# Altium schematic sheet Microcontroller.SchDoc
size A4
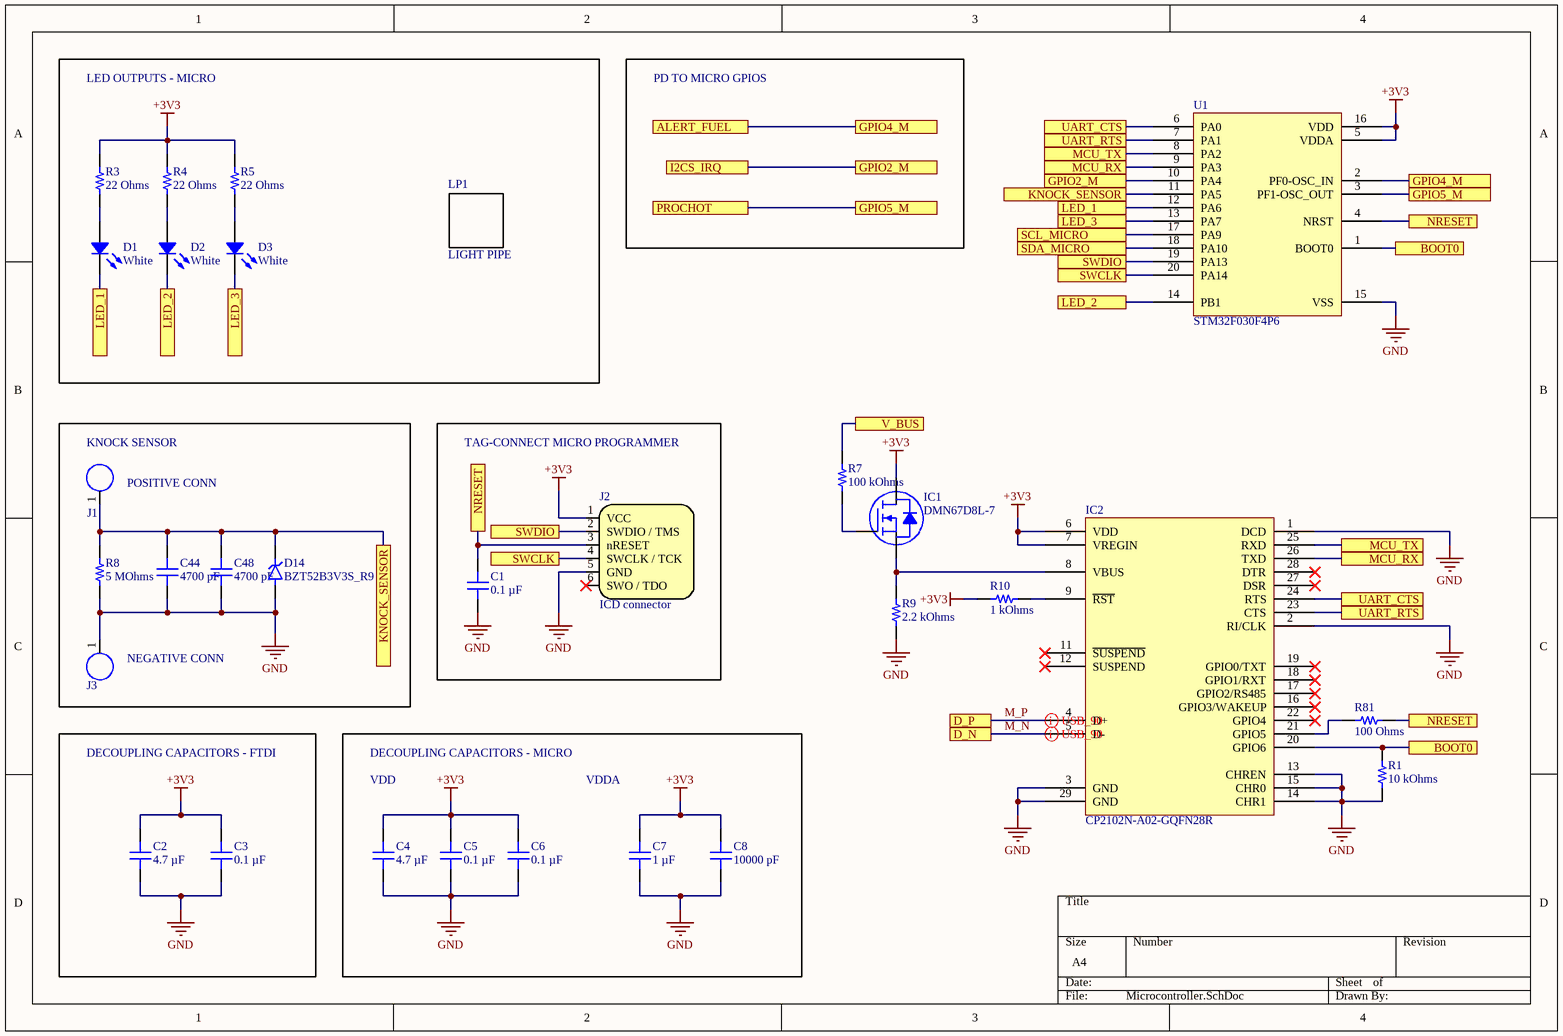
[diagram p0: Microcontroller.SchDoc]

## Parts
C1  0.1 µF  [CAP 0402_1005]
C2  4.7 µF  [CAP 0402_1005]
C3  0.1 µF  [CAP 0402_1005]
C4  4.7 µF  [CAP 0402_1005]
C5  0.1 µF  [CAP 0402_1005]
C6  0.1 µF  [CAP 0402_1005]
C7  1 µF  [CAP 0402_1005]
C8  10000 pF  [CAP 0402_1005]
C44  4700 pF  [CAP 0402_1005]
C48  4700 pF  [CAP 0402_1005]
D1  White  [LED 0805_2012]
D2  White  [LED 0805_2012]
D3  White  [LED 0805_2012]
D14  BZT52B3V3S_R9  [DIO_BZT52B3V3S_R9]
IC1  DMN67D8L-7  [DIODES SOT-23-3]
IC2  CP2102N-A02-GQFN28R  [SILICON LABS QFN-28 5x5MM]
J1  Large Board Solder Point  [Large Solder Point]  (value not drawn)  (no BOM)
J2  ICD connector  [TC2030-MCP]  (no BOM)
J3  Large Board Solder Point  [Large Solder Point]  (value not drawn)  (no BOM)
LP1  LIGHT PIPE  [Dialight 515-1069F]
R1  10 kOhms  [RES 0402_1005]
R3  22 Ohms  [RES 1206_3216]
R4  22 Ohms  [RES 1206_3216]
R5  22 Ohms  [RES 1206_3216]
R7  100 kOhms  [RES 0603_1608]
R8  5 MOhms  [RES 0603_1608]
R9  2.2 kOhms  [RES 0402_1005]
R10  1 kOhms  [RES 0402_1005]
R81  100 Ohms  [RES 0402_1005]
U1  STM32F030F4P6  [TSOP65P640X120-20N]

## Blocks framed on the sheet
LED OUTPUTS - MICRO: D1-D3 LP1 R3-R5
TAG-CONNECT MICRO PROGRAMMER: C1 J2
DECOUPLING CAPACITORS - FTDI: C2 C3

## Ports
ALERT_FUEL, BOOT0, D_N, D_P, GPIO2_M, GPIO4_M, GPIO5_M, I2CS_IRQ, KNOCK_SENSOR, LED_1, LED_2, LED_3, MCU_RX, MCU_TX, NRESET, PROCHOT, SCL_MICRO, SDA_MICRO, SWCLK, SWDIO, UART_CTS, UART_RTS, V_BUS

## Nets
+3V3: C2.2 C3.2 C4.2 C5.2 C6.2 C7.2 C8.2 IC1.3(D) IC2.6(VDD) IC2.7(VREGIN) J2.1(VCC) R3.2 R4.2 R5.2 R10.1 U1.5(VDDA) U1.16(VDD)
GND: C1.1 C2.1 C3.1 C4.1 C5.1 C6.1 C7.1 C8.1 C44.1 C48.1 D14.A IC2.1(DCD) IC2.2(RI/CLK) IC2.3(GND) IC2.13(CHREN) IC2.14(CHR1) IC2.15(CHR0) IC2.29(GND) J2.5(GND) J3.1 R1.2 R8.1 R9.1 U1.15(VSS)
ALERT_FUEL: U1.2(PF0-OSC_IN) ; port GPIO4_M, port ALERT_FUEL
BOOT0: IC2.20(GPIO6) R1.1 U1.1(BOOT0) ; port BOOT0
GPIO2_M: U1.10(PA4) ; port GPIO2_M, port I2CS_IRQ
GPIO5_M: U1.3(PF1-OSC_OUT) ; port GPIO5_M, port PROCHOT
KNOCK_SENSOR: C44.2 C48.2 D14.C(K) J1.1 R8.2 U1.11(PA5) ; port KNOCK_SENSOR
LED_1: D1.2 U1.12(PA6) ; port LED_1
LED_2: D2.2 U1.14(PB1) ; port LED_2
LED_3: D3.2 U1.13(PA7) ; port LED_3
M_N: IC2.5(D-) ; port D_N
M_P: IC2.4(D+) ; port D_P
MCU_RX: IC2.26(TXD) U1.9(PA3) ; port MCU_RX
MCU_TX: IC2.25(RXD) U1.8(PA2) ; port MCU_TX
NRESET: C1.2 J2.3(nRESET) R81.2 U1.4(NRST) ; port NRESET
SCL_MICRO: U1.17(PA9) ; port SCL_MICRO
SDA_MICRO: U1.18(PA10) ; port SDA_MICRO
SWCLK: J2.4(SWCLK_/_TCK) U1.20(PA14) ; port SWCLK
SWDIO: J2.2(SWDIO_/_TMS) U1.19(PA13) ; port SWDIO
UART_CTS: IC2.24(RTS) U1.6(PA0) ; port UART_CTS
UART_RTS: IC2.23(CTS) U1.7(PA1) ; port UART_RTS
V_BUS: R7.2 ; port V_BUS
NetD1_1: D1.1 R3.1
NetD2_1: D2.1 R4.1
NetD3_1: D3.1 R5.1
NetIC1_1: IC1.1(G) R7.1
NetIC1_2: IC1.2(S) IC2.8(VBUS) R9.2
NetIC2_9: IC2.9(~{RST}) R10.2
NetIC2_21: IC2.21(GPIO5) R81.1

Not connected (* = marked no-connect by the designer): IC2 11(~{SUSPEND})* 12(SUSPEND)* 16(GPIO3/WAKEUP)* 17(GPIO2/RS485)* 18(GPIO1/RXT)* 19(GPIO0/TXT)* 22(GPIO4)* 27(DSR)* 28(DTR)*; J2 6(SWO_/_TDO)*

## Layout directives
differential pair; differential pair class USB_90: M_N, M_P

## Notes on the sheet
- PD TO MICRO GPIOS
- (near J1) KNOCK SENSOR
- (near J1) POSITIVE CONN
- (near J3) NEGATIVE CONN
- DECOUPLING CAPACITORS - MICRO
- VDD
- VDDA

## Library data of the parts
C1 C3 C5 C6 = LMK105BJ104MC-F: CAP CER 0.1UF 10V X5R 0402; manufacturer: Taiyo Yuden; Tolerance: ±20%; Part Number: LMK105BJ104MC-F; Value: 0.1 µF; Applications: SMPS Filtering; Capacitance: 0.1 µF; componentlink1description: Datasheet; componentlink1url: https://www.yuden.co.jp/productdata/catalog/mlcc01_e.pdf; componentlink2description: DigiKey Link; componentlink2url: https://www.digikey.com/en/products/detail/taiyo-yuden/LMK105BJ104MC-F/6035743; Device Package: 0402 (1005 Metric); lastupdated: 9/08/2022 12:01:16 PM; Lifecycle Status: Active; Minimum Order: 1; Mounting Type: Surface Mount, MLCC; Operating Temperature: -55°C ~ 85°C; Package / Case: 0402 (1005 Metric); packaging: TapeAndReel; partid: 2414; Part Status: Active; price: 0.03; series: M; Size / Dimension: 0.039" L x 0.020" W (1.00mm x 0.50mm); Supplier 1: DigiKey; Supplier Part Number 1: 587-4572-1-ND; Temperature Coefficient: X5R; Thickness (Max): 0.009" (0.22mm); Voltage - Rated: 10V
C2 C4 = CL05A475KP5NRNC: CAP CER 4.7UF 10V X5R 0402; manufacturer: Samsung Electro-Mechanics; Tolerance: ±10%; Part Number: CL05A475KP5NRNC; Value: 4.7 µF; Applications: General Purpose; Capacitance: 4.7 µF; componentlink1description: Datasheet; componentlink1url: http://www.samsungsem.com/kr/support/product-search/mlcc/CL05A475KP5NRNC.jsp; componentlink2description: DigiKey Link; componentlink2url: https://www.digikey.com/en/products/detail/samsung-electro-mechanics/CL05A475KP5NRNC/3887138; Device Package: 0402 (1005 Metric); lastupdated: 9/08/2022 12:01:16 PM; Lifecycle Status: Active; Minimum Order: 1; Mounting Type: Surface Mount, MLCC; Operating Temperature: -55°C ~ 85°C; Package / Case: 0402 (1005 Metric); packaging: TapeAndReel; partid: 2191; Part Status: Active; price: 0.04; series: CL; Size / Dimension: 0.039" L x 0.020" W (1.00mm x 0.50mm); Supplier 1: DigiKey; Supplier Part Number 1: 1276-1480-1-ND; Temperature Coefficient: X5R; Thickness (Max): 0.022" (0.55mm); Voltage - Rated: 10V
C7 = LMK105BJ105KPLF: CAP CER 1UF 10V X5R 0402; manufacturer: Taiyo Yuden; Tolerance: ±10%; Part Number: LMK105BJ105KPLF; Value: 1 µF; Applications: SMPS Filtering; Capacitance: 1 µF; componentlink1description: Datasheet; componentlink1url: https://ds.yuden.co.jp/TYCOMPAS/ut/detail?pn=LMK105BJ105KPLF &u=M; componentlink2description: DigiKey Link; componentlink2url: https://www.digikey.com/en/products/detail/taiyo-yuden/LMK105BJ105KPLF/7403744; Device Package: 0402 (1005 Metric); lastupdated: 9/08/2022 12:01:16 PM; Lifecycle Status: Active; Minimum Order: 1; Mounting Type: Surface Mount, MLCC; Operating Temperature: -55°C ~ 85°C; Package / Case: 0402 (1005 Metric); packaging: TapeAndReel; partid: 2328; Part Status: Active; price: 0.02; series: M; Size / Dimension: 0.039" L x 0.020" W (1.00mm x 0.50mm); Supplier 1: DigiKey; Supplier Part Number 1: 587-6274-1-ND; Temperature Coefficient: X5R; Thickness (Max): 0.026" (0.65mm); Voltage - Rated: 10V
C8 = LMF105B7103KVHF: CAP, MLCC, 0402/1005, 10V, X7R,; manufacturer: Taiyo Yuden; Tolerance: ±10%; Part Number: LMF105B7103KVHF; Value: 10000 pF; Applications: Automotive, SMPS Filtering; Capacitance: 10000 pF; componentlink1description: Datasheet; componentlink1url: https://ds.yuden.co.jp/TYCOMPAS/ut/detail?pn=LMF105B7103KVHF&u=M; componentlink2description: DigiKey Link; componentlink2url: https://www.digikey.com/en/products/detail/taiyo-yuden/LMF105B7103KVHF/10379145; Device Package: 0402 (1005 Metric); lastupdated: 9/08/2022 12:01:17 PM; Lifecycle Status: Active; Minimum Order: 1; Mounting Type: Surface Mount, MLCC; Operating Temperature: -55°C ~ 125°C; Package / Case: 0402 (1005 Metric); packaging: TapeAndReel; partid: 1869; Part Status: Active; price: 0.01; Ratings: AEC-Q200; series: M; Size / Dimension: 0.039" L x 0.020" W (1.00mm x 0.50mm); Supplier 1: DigiKey; Supplier Part Number 1: 587-6579-1-ND; Temperature Coefficient: X7R; Thickness (Max): 0.022" (0.55mm); Voltage - Rated: 10V
C44 C48 = 0402B472J500CT: CAP CER 4700PF 50V X7R 0402; manufacturer: Walsin Technology Corporation; Tolerance: ±5%; Part Number: 0402B472J500CT; Value: 4700 pF; Applications: General Purpose; Capacitance: 4700 pF; componentlink1description: Datasheet; componentlink1url: http://www.passivecomponent.com/wp-content/uploads/2018/10/MLCC.pdf; componentlink2description: DigiKey Link; componentlink2url: https://www.digikey.com/en/products/detail/walsin-technology-corporation/0402B472J500CT/9354708; Device Package: 0402 (1005 Metric); lastupdated: 11/05/2023 7:06:21 PM; Lifecycle Status: Active; Minimum Order: 1; Mounting Type: Surface Mount, MLCC; Operating Temperature: -55°C ~ 125°C; Package / Case: 0402 (1005 Metric); packaging: TapeAndReel; partid: 1879; Part Status: Active; price: 0.01; series: -; Size / Dimension: 0.039" L x 0.020" W (1.00mm x 0.50mm); Supplier 1: DigiKey; Supplier Part Number 1: 1292-1210-1-ND; Temperature Coefficient: X7R; Thickness (Max): 0.022" (0.55mm); Voltage - Rated: 50V
D1-D3 = QBLP631-IW5: 0805 LED WHITE, YELLOW DIFFUSED; Manufacturer: QT Brightek (QTB); Configuration: Standard; Current - Test: 5mA; Lens Size: 1.30mm x 1.25mm; Lens Style: Rectangle with Flat Top; Millicandela Rating: 85mcd; Viewing Angle: 140°; Voltage - Forward (Vf) (Typ): 2.9V; Part Number: QBLP631-IW5; Color: White; ComponentLink1Description: Datasheet; ComponentLink1URL: https://www.qt-brightek.com/datasheet/QBLP631-IW5.pdf; ComponentLink2Description: DigiKey Link; ComponentLink2URL: https://www.digikey.com/en/products/detail/qt-brightek-qtb/QBLP631-IW5/16499651; Device Package: 0805 (2012 Metric); Height (Max): 0.90mm; LastUpdated: 9/08/2022 12:43:05 PM; Lens Color: Yellow; Lens Transparency: Diffused; Lifecycle Status: Active; Minimum Order: 1; Mounting Type: Surface Mount; Package / Case: 0805 (2012 Metric); Packaging: TapeAndReel; PartId: 1097; Part Status: Active; Price: 0.08; Series: QBLP631; Size / Dimension: 2.00mm L x 1.25mm W; Supplier 1: DigiKey; Supplier Part Number 1: 1516-QBLP631-IW5CT-ND; Supplier Device Package: 0805; Value: White
D14 = BZT52B3V3S_R9: MF: {'manufacturer': u'Taiwan Semiconductor'}; Package: None; Price: None; Value: *; MP: BZT52B3V3S_R9; Availability: Unavailable
IC1 = DMN67D8L-7: MOSFET N-CH 60V 210MA SOT23; Manufacturer: Diodes Incorporated; Current - Continuous Drain (Id) @ 25°C: 210mA (Ta); Drive Voltage (Max Rds On,  Min Rds On): 5V, 10V; FET Type: N-Channel; Gate Charge (Qg) (Max) @ Vgs: 0.82 nC @ 10 V; Input Capacitance (Ciss) (Max) @ Vds: 22 pF @ 25 V; Power Dissipation (Max): 340mW (Ta); Rds On (Max) @ Id, Vgs: 5Ohm @ 500mA, 10V; Vgs (Max): ±30V; Vgs(th) (Max) @ Id: 2.5V @ 250µA; Part Number: DMN67D8L-7; ComponentLink1Description: Datasheet; ComponentLink1URL: https://www.diodes.com/assets/Datasheets/DMN67D8L.pdf; ComponentLink2Description: DigiKey Link; ComponentLink2URL: https://www.digikey.com/en/products/detail/diodes-incorporated/DMN67D8L-7/5768832; Drain to Source Voltage (Vdss): 60 V; LastUpdated: 9/08/2022 12:48:06 PM; Lifecycle Status: Active; Minimum Order: 1; Mounting Type: Surface Mount; Operating Temperature: -55°C ~ 150°C (TJ); Package / Case: TO-236-3, SC-59, SOT-23-3; Packaging: TapeAndReel; Part Status: Active; Price: 0.03; Series: -; Supplier 1: DigiKey; Supplier Part Number 1: DMN67D8L-7DICT-ND; Supplier Device Package: SOT-23-3; Technology: MOSFET (Metal Oxide)
IC2 = CP2102N-A02-GQFN28R: IC USB TO UART BRIDGE QFN28; Manufacturer: Silicon Labs; Current - Supply: 9.5mA; Function: Bridge, USB to UART; Standards: USB 2.0; Voltage - Supply: 3V ~ 3.6V; Part Number: CP2102N-A02-GQFN28R; ComponentLink1Description: Datasheet; ComponentLink1URL: https://www.silabs.com/documents/public/data-sheets/cp2102n-datasheet.pdf; ComponentLink2Description: DigiKey Link; ComponentLink2URL: http://digikey.com/product-detail/en/silicon-labs/CP2102N-A02-GQFN28R/336-5890-1-ND/9863483; Interface: UART; LastUpdated: 31/07/2020 4:26:30 PM; Lifecycle Status: Active; Minimum Order: 1; Operating Temperature: -40°C ~ 85°C (TA); Package / Case: 28-WFQFN Exposed Pad; Packaging: TapeAndReel; Part Status: Active; Price: 1.23; Protocol: USB; Series: USBXpress™; Supplier 1: DigiKey; Supplier Part Number 1: 336-5890-1-ND; Supplier Device Package: 28-QFN (5x5)
J2 = TC2030-MCP-NL: Conector par ICD
LP1 = Dialight 515-1069F: Light Pipe Dialight 515-1069F
R1 = RC0402JR-1310KL: RES 10K OHM 5% 1/16W 0402; Manufacturer: Yageo; Power (Watts): 0.063W, 1/16W; Temperature Coefficient: ±100ppm/°C; Part Number: RC0402JR-1310KL; Value: 10 kOhms; ComponentLink1Description: Datasheet; ComponentLink1URL: https://www.yageo.com/upload/media/product/productsearch/datasheet/rchip/PYu-RC_Group_51_RoHS_L_11.pdf; ComponentLink2Description: DigiKey Link; ComponentLink2URL: https://www.digikey.com/en/products/detail/yageo/RC0402JR-1310KL/13694115; Composition: Thick Film; Device Package: 0402 (1005 Metric); Features: Moisture Resistant; Height - Seated (Max): 0.016" (0.40mm); LastUpdated: 4/04/2023 7:21:31 PM; Lifecycle Status: Active; Minimum Order: 50000; Number of Terminations: 2; Operating Temperature: -55°C ~ 155°C; Package / Case: 0402 (1005 Metric); PartId: 69237; Part Status: Active; Price: 0; Resistance: 10 kOhms; Series: RC_L; Size / Dimension: 0.039" L x 0.020" W (1.00mm x 0.50mm); Supplier 1: DigiKey; Supplier Part Number 1: 13-RC0402JR-1310KLTR-ND; Supplier Device Package: 0402; Tolerance: ±5%
R3-R5 = HRG3216Q-22R0-D-T1: RES SMD 22 OHM 0.5% 1W 1206; Manufacturer: Susumu; Temperature Coefficient: ±50ppm/°C; Part Number: HRG3216Q-22R0-D-T1; ComponentLink1Description: Datasheet; ComponentLink1URL: http://www.susumu.co.jp/common/pdf/n_catalog_partition24_en.pdf; ComponentLink2Description: DigiKey Link; ComponentLink2URL: https://www.digikey.com/en/products/detail/susumu/HRG3216Q-22R0-D-T1/5762558; Composition: Thin Film; Device Package: 1206 (3216 Metric); Features: Anti-Sulfur, Automotive AEC-Q200, Moisture Resistant; Height - Seated (Max): 0.022" (0.55mm); LastUpdated: 19/09/2022 1:29:16 PM; Lifecycle Status: Active; Minimum Order: 1; Number of Terminations: 2; Operating Temperature: -55°C ~ 155°C; Package / Case: 1206 (3216 Metric); Packaging: TapeAndReel; PartId: 35615; Part Status: Active; Power (Watts): 1W; Price: 0.30; Ratings: AEC-Q200; Resistance: 22 Ohms; Series: HRG; Size / Dimension: 0.126" L x 0.065" W (3.20mm x 1.65mm); Supplier 1: DigiKey; Supplier Part Number 1: 408-1897-1-ND; Supplier Device Package: 1206; Tolerance: ±0.5%; Value: 22 Ohms
R7 = RNCS0603BKE100K: RES 100K OHM 0.1% 1/16W 0603; Manufacturer: Stackpole Electronics Inc; Power (Watts): 0.063W, 1/16W; Temperature Coefficient: ±25ppm/°C; Part Number: RNCS0603BKE100K; Value: 100 kOhms; ComponentLink1Description: Datasheet; ComponentLink1URL: https://www.seielect.com/catalog/sei-rncs_rnch.pdf; ComponentLink2Description: DigiKey Link; ComponentLink2URL: https://www.digikey.com/en/products/detail/stackpole-electronics-inc/RNCS0603BKE100K/1708835; Composition: Thin Film; Device Package: 0603 (1608 Metric); Features: Anti-Corrosive, Automotive AEC-Q200, Moisture Resistant; Height - Seated (Max): 0.022" (0.55mm); LastUpdated: 19/09/2022 1:22:34 PM; Lifecycle Status: Active; Minimum Order: 1; Number of Terminations: 2; Operating Temperature: -55°C ~ 155°C; Package / Case: 0603 (1608 Metric); Packaging: TapeAndReel; PartId: 4849; Part Status: Active; Price: 0.08; Ratings: AEC-Q200; Resistance: 100 kOhms; Series: RNCS; Size / Dimension: 0.061" L x 0.031" W (1.55mm x 0.80mm); Supplier 1: DigiKey; Supplier Part Number 1: RNCS0603BKE100KCT-ND; Supplier Device Package: 0603; Tolerance: ±0.1%
R8 = HVC0603T5004FET: RES SMD 5M OHM 1% 1/10W 0603; Manufacturer: Ohmite; Power (Watts): 0.1W, 1/10W; Temperature Coefficient: ±100ppm/°C; Part Number: HVC0603T5004FET; Value: 5 MOhms; ComponentLink1Description: Datasheet; ComponentLink1URL: http://www.ohmite.com/assets/docs/res_hvc.pdf?r=false; ComponentLink2Description: DigiKey Link; ComponentLink2URL: https://www.digikey.com/en/products/detail/ohmite/HVC0603T5004FET/4759723; Composition: Thick Film; Device Package: 0603 (1608 Metric); Features: High Voltage; Height - Seated (Max): 0.022" (0.55mm); LastUpdated: 11/07/2023 7:33:32 PM; Lifecycle Status: Active; Minimum Order: 1; Number of Terminations: 2; Operating Temperature: -55°C ~ 155°C; Package / Case: 0603 (1608 Metric); Packaging: TapeAndReel; PartId: 18926; Part Status: Active; Price: 0.68; Resistance: 5 MOhms; Series: HVC; Size / Dimension: 0.059" L x 0.031" W (1.50mm x 0.80mm); Supplier 1: DigiKey; Supplier Part Number 1: HVC0603T5004FETCT-ND; Supplier Device Package: 0603; Tolerance: ±1%
R9 = TNPW04022K20BYEP: RES 2.2K OHM 0.1% 1/10W 0402; Manufacturer: Vishay Dale; Power (Watts): 0.1W, 1/10W; Temperature Coefficient: ±10ppm/°C; Part Number: TNPW04022K20BYEP; Value: 2.2 kOhms; ComponentLink1Description: Datasheet; ComponentLink1URL: http://www.vishay.com/docs/28758/tnpw_e3.pdf; ComponentLink2Description: DigiKey Link; ComponentLink2URL: https://www.digikey.com/en/products/detail/vishay-dale/TNPW04022K20BYEP/8636618; Composition: Thin Film; Device Package: 0402 (1005 Metric); Features: Anti-Sulfur, Automotive AEC-Q200, Moisture Resistant; Height - Seated (Max): 0.016" (0.40mm); LastUpdated: 9/08/2022 12:11:02 PM; Lifecycle Status: Active; Minimum Order: 1; Number of Terminations: 2; Operating Temperature: -55°C ~ 155°C; Package / Case: 0402 (1005 Metric); Packaging: TapeAndReel; PartId: 3077; Part Status: Active; Price: 0.28; Ratings: AEC-Q200; Resistance: 2.2 kOhms; Series: TNPW e3; Size / Dimension: 0.039" L x 0.020" W (1.00mm x 0.50mm); Supplier 1: DigiKey; Supplier Part Number 1: 541-9805-1-ND; Supplier Device Package: 0402; Tolerance: ±0.1%
R10 = AF0402JR-071KL: RES SMD 1K OHM 5% 1/16W 0402; Manufacturer: Yageo; Power (Watts): 0.063W, 1/16W; Temperature Coefficient: ±100ppm/°C; Part Number: AF0402JR-071KL; Value: 1 kOhms; ComponentLink1Description: Datasheet; ComponentLink1URL: https://www.yageo.com/upload/media/product/productsearch/datasheet/rchip/PYu-AF_51_RoHS_L_6.pdf; ComponentLink2Description: DigiKey Link; ComponentLink2URL: https://www.digikey.com/en/products/detail/yageo/AF0402JR-071KL/5900732; Composition: Thick Film; Device Package: 0402 (1005 Metric); Features: Anti-Sulfur, Automotive AEC-Q200; Height - Seated (Max): 0.015" (0.37mm); LastUpdated: 9/08/2022 12:09:39 PM; Lifecycle Status: Active; Minimum Order: 1; Number of Terminations: 2; Operating Temperature: -55°C ~ 155°C; Package / Case: 0402 (1005 Metric); Packaging: CutTape; PartId: 68908; Part Status: Active; Price: 0.01; Ratings: AEC-Q200; Resistance: 1 kOhms; Series: AF; Size / Dimension: 0.039" L x 0.020" W (1.00mm x 0.50mm); Supplier 1: DigiKey; Supplier Part Number 1: 13-AF0402JR-071KLCT-ND; Supplier Device Package: 0402; Tolerance: ±5%
R81 = MCS0402PD1000DE500: RES 100 OHM 0.5% 1/5W 0402; Manufacturer: Vishay Beyschlag; Power (Watts): 0.2W, 1/5W; Temperature Coefficient: ±25ppm/°C; Part Number: MCS0402PD1000DE500; Value: 100 Ohms; ComponentLink1Description: Datasheet; ComponentLink1URL: http://www.vishay.com/docs/28916/mcxhp.pdf; ComponentLink2Description: DigiKey Link; ComponentLink2URL: http://digikey.com/product-detail/en/vishay-beyschlag/MCS0402PD1000DE500/749-1509-1-ND/7245027; Composition: Thin Film; Device Package: 0402 (1005 Metric); Features: Anti-Sulfur, Automotive AEC-Q200; Height - Seated (Max): 0.015" (0.37mm); LastUpdated: 17/07/2023 7:08:51 PM; Lifecycle Status: Active; Minimum Order: 1; Number of Terminations: 2; Operating Temperature: -55°C ~ 175°C; Package / Case: 0402 (1005 Metric); Packaging: TapeAndReel; PartId: 2456; Part Status: Active; Price: 0.08; Ratings: AEC-Q200; Resistance: 100 Ohms; Series: MCS HP; Size / Dimension: 0.039" L x 0.020" W (1.00mm x 0.50mm); Supplier 1: DigiKey; Supplier Part Number 1: 749-1509-1-ND; Supplier Device Package: 0402; Tolerance: ±0.5%
U1 = STM32F030F4P6: Value-line Arm-based 32-bit MCU with up to 256 KB Flash, timers, ADC, communication interfaces, 2.4-3.6 V operation - TSSOP20 20-pin